# EAGLE design w20-cloudV1-(3_3)OHW (EAGLE 6.6.0)
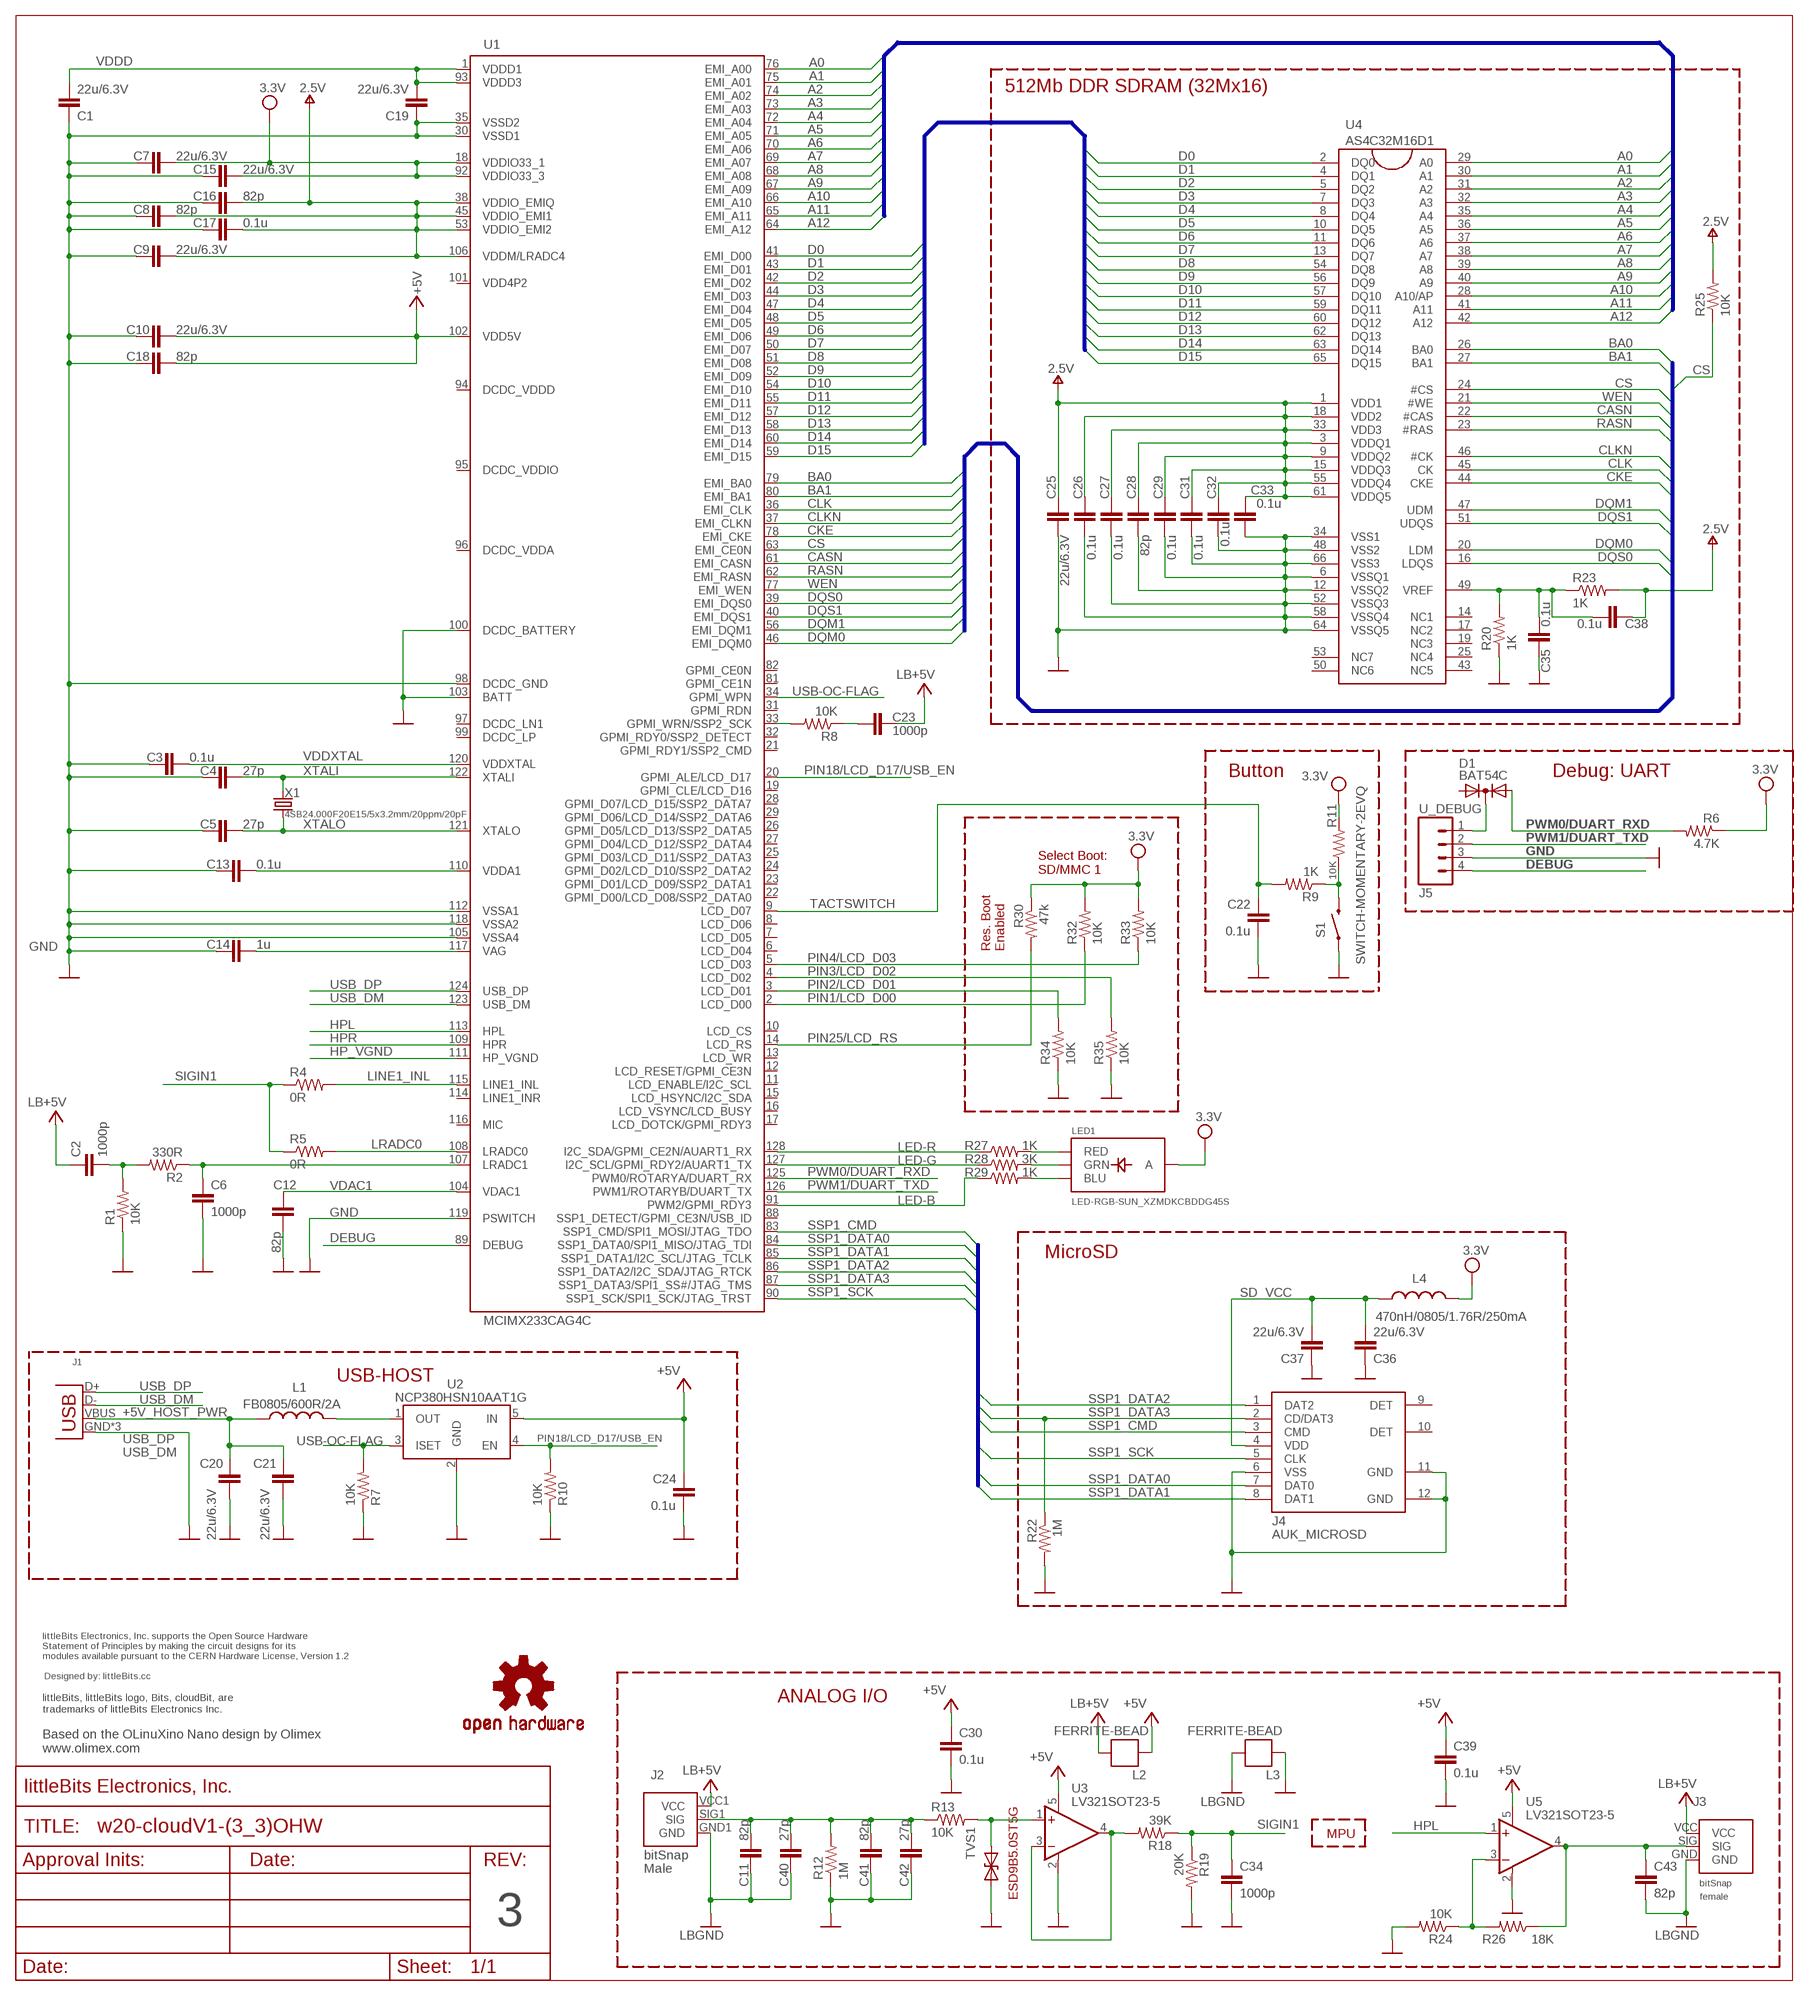
[diagram p0: schematic, sheet 1]

## Parts
C1  22u/6.3V  CAPCAP-0603  [CAP-0603]
C2  1000p  CAPCAP-0603  [CAP-0603]
C3  0.1u  CAPCAP-0402  [CAP-0402]
C4  27p  CAPCAP-0402  [CAP-0402]
C5  27p  CAPCAP-0402  [CAP-0402]
C6  1000p  CAPCAP-0402  [CAP-0402]
C7  22u/6.3V  CAPCAP-0603  [CAP-0603]
C8  82p  CAPCAP-0402  [CAP-0402]
C9  22u/6.3V  CAPCAP-0603  [CAP-0603]
C10  22u/6.3V  CAPCAP-0603  [CAP-0603]
C11  82p  CAPCAP-0402  [CAP-0402]
C12  82p  CAPCAP-0402  [CAP-0402]
C13  0.1u  CAPCAP-0402  [CAP-0402]
C14  1u  CAPCAP-0402  [CAP-0402]
C15  22u/6.3V  CAPCAP-0603  [CAP-0603]
C16  82p  CAPCAP-0402  [CAP-0402]
C17  0.1u  CAPCAP-0402  [CAP-0402]
C18  82p  CAPCAP-0402  [CAP-0402]
C19  22u/6.3V  CAPCAP-0603  [CAP-0603]
C20  22u/6.3V  CAPCAP-0603  [CAP-0603]
C21  22u/6.3V  CAPCAP-0603  [CAP-0603]
C22  0.1u  CAPCAP-0402  [CAP-0402]
C23  1000p  CAPCAP-0603  [CAP-0603]
C24  0.1u  CAPCAP-0402  [CAP-0402]
C25  22u/6.3V  CAPCAP-0603  [CAP-0603]
C26  0.1u  CAPCAP-0402  [CAP-0402]
C27  0.1u  CAPCAP-0402  [CAP-0402]
C28  82p  CAPCAP-0402  [CAP-0402]
C29  0.1u  CAPCAP-0402  [CAP-0402]
C30  0.1u  CAPCAP-0402  [CAP-0402]
C31  0.1u  CAPCAP-0402  [CAP-0402]
C32  0.1u  CAPCAP-0402  [CAP-0402]
C33  0.1u  CAPCAP-0402  [CAP-0402]
C34  1000p  CAPCAP-0402  [CAP-0402]
C35  0.1u  CAPCAP-0402  [CAP-0402]
C36  22u/6.3V  CAPCAP-0603  [CAP-0603]
C37  22u/6.3V  CAPCAP-0603  [CAP-0603]
C38  0.1u  CAPCAP-0402  [CAP-0402]
C39  0.1u  CAPCAP-0402  [CAP-0402]
C40  27p  CAPCAP-0402  [CAP-0402]
C41  82p  CAPCAP-0402  [CAP-0402]
C42  27p  CAPCAP-0402  [CAP-0402]
C43  82p  CAPCAP-0402  [CAP-0402]
D1  BAT54C  DIODE_AC-CA_  [SOT23C]
J1  USBFEMALE  [USB-A-H-FEMALE]
J2  BITSNAP_V03_MALE  [BITSNAP_V03_MALE]
J3  BITSNAP_V03_FEMALE  [BITSNAP_V03_FEMALE]
J4  AUK_MICROSD  [AUK_TFC08WP01-R1K-H]
J5  U_DEBUG  HDR-4SM_SML  [SIP4-SM-0.1IN-NOS.S.]
L1  FB0805/600R/2A  L-USL0805_5MIL_DWS  [L0805_5MIL_DWS]
L2  FERRITE-BEAD  [R0603]
L3  FERRITE-BEAD  [R0603]
L4  470nH/0805/1.76R/250mA  L-USL0805_5MIL_DWS  [L0805_5MIL_DWS]
LED1  LED-RGB-SUN_XZMDKCBDDG45S  [LED-RGB-SUN_XZMDKCBDDG45S]
R1  10K  RESISTOR0603  [RES-0603]
R2  330R  RESISTOR0603  [RES-0603]
R4  0R  RESISTOR0603  [RES-0603]
R5  0R  RESISTOR0603  [RES-0603]
R6  4.7K  RESISTOR0603  [RES-0603]
R7  10K  RESISTOR0603  [RES-0603]
R8  10K  RESISTOR0603  [RES-0603]
R9  1K  RESISTOR0603  [RES-0603]
R10  10K  RESISTOR0603  [RES-0603]
R11  10K  RESISTOR0603  [RES-0603]
R12  1M  RESISTOR0603  [RES-0603]
R13  10K  RESISTOR0603  [RES-0603]
R18  39K  RESISTOR0603  [RES-0603]
R19  20K  RESISTOR0603  [RES-0603]
R20  1K  RESISTOR0603  [RES-0603]
R22  1M  RESISTOR0603  [RES-0603]
R23  1K  RESISTOR0603  [RES-0603]
R24  10K  RESISTOR0603  [RES-0603]
R25  10K  RESISTOR0603  [RES-0603]
R26  18K  RESISTOR0603  [RES-0603]
R27  1K  RESISTOR0603  [RES-0603]
R28  3K  RESISTOR0603  [RES-0603]
R29  1K  RESISTOR0603  [RES-0603]
R30  47k  RESISTOR0603  [RES-0603]
R32  10K  RESISTOR0603  [RES-0603]
R33  10K  RESISTOR0603  [RES-0603]
R34  10K  RESISTOR0603  [RES-0603]
R35  10K  RESISTOR0603  [RES-0603]
S1  SWITCH-MOMENTARY-2EVQ  [TACTILE-SWITCH-EVQ-PE104K]
TVS1  DIODE-TVSSOD-923  [SOD-923]
U1  MCIMX233CAG4C  MCIMX233DAG4B_LD  [TQFP128LD]
U2  NCP380HSN10AAT1G  SY6280  [SOT23-5]
U3  LV321SOT23-5  [SOT23-5]
U4  AS4C32M16D1  HY5DU121622D(L)T(P)-J  [66TSOP-II]
U5  LV321SOT23-5  [SOT23-5]
U$2  OSHWCREDIT  [OSHWCREDIT]
U$4  OSHW-LOGOL  [OSHW-LOGO-L]
U$5  FRAME-LETTER-OHWOHW  [FABDWG01-OHW]
X1  4SB24.000F20E15/5x3.2mm/20ppm/20pF  HC49/S_E4SB25.000F20E15  [HCX-4S]

## Nets
+5V: C10.2 C18.2 C24.1 C30.1 C39.1 L2.2 U1.102(VDD5V) U2.5(IN) U3.5(V+) U5.5(V+)
+5V_HOST_PWR: C20.1 C21.1 J1.VBUS L1.1
A0: U1.76(EMI_A00) U4.29(A0)
A1: U1.75(EMI_A01) U4.30(A1)
A2: U1.74(EMI_A02) U4.31(A2)
A3: U1.73(EMI_A03) U4.32(A3)
A4: U1.72(EMI_A04) U4.35(A4)
A5: U1.71(EMI_A05) U4.36(A5)
A6: U1.70(EMI_A06) U4.37(A6)
A7: U1.69(EMI_A07) U4.38(A7)
A8: U1.68(EMI_A08) U4.39(A8)
A9: U1.67(EMI_A09) U4.40(A9)
A10: U1.66(EMI_A10) U4.28(A10/AP)
A11: U1.65(EMI_A11) U4.41(A11)
A12: U1.64(EMI_A12) U4.42(A12)
BA0: U1.79(EMI_BA0) U4.26(BA0)
BA1: U1.80(EMI_BA1) U4.27(BA1)
CASN: U1.61(EMI_CASN) U4.22(#CAS)
CKE: U1.78(EMI_CKE) U4.44(CKE)
CLK: U1.36(EMI_CLK) U4.45(CK)
CLKN: U1.37(EMI_CLKN) U4.46(#CK)
CS: R25.1 U1.63(EMI_CE0N) U4.24(#CS)
D0: U1.41(EMI_D00) U4.2(DQ0)
D1: U1.43(EMI_D01) U4.4(DQ1)
D2: U1.42(EMI_D02) U4.5(DQ2)
D3: U1.44(EMI_D03) U4.7(DQ3)
D4: U1.47(EMI_D04) U4.8(DQ4)
D5: U1.48(EMI_D05) U4.10(DQ5)
D6: U1.49(EMI_D06) U4.11(DQ6)
D7: U1.50(EMI_D07) U4.13(DQ7)
D8: U1.51(EMI_D08) U4.54(DQ8)
D9: U1.52(EMI_D09) U4.56(DQ9)
D10: U1.54(EMI_D10) U4.57(DQ10)
D11: U1.55(EMI_D11) U4.59(DQ11)
D12: U1.57(EMI_D12) U4.60(DQ12)
D13: U1.58(EMI_D13) U4.62(DQ13)
D14: U1.60(EMI_D14) U4.63(DQ14)
D15: U1.59(EMI_D15) U4.65(DQ15)
DEBUG: J5.4 U1.89(DEBUG)
DQM0: U1.46(EMI_DQM0) U4.20(LDM)
DQM1: U1.56(EMI_DQM1) U4.47(UDM)
DQS0: U1.39(EMI_DQS0) U4.16(LDQS)
DQS1: U1.40(EMI_DQS1) U4.51(UDQS)
GND [pwr-II]: C1.1 C3.1 C4.1 C5.1 C6.2 C7.1 C8.1 C9.1 C10.1 C12.2 C13.1 C14.1 C15.1 C16.1 C17.1 C18.1 C19.1 C20.2 C21.2 C22.2 C24.2 C25.1 C26.1 C27.1 C28.1 C29.1 C30.2 C31.1 C32.1 C33.1 C34.2 C35.1 C36.1 C37.1 C39.2 C41.2 C42.2 J1.GND J1.GND@1(GND) J1.GND@2(GND) J4.6(VSS) J4.11(GND) J4.12(GND) J5.3 L3.2 R1.1 R7.1 R10.1 R12.1 R19.2 R20.1 R22.2 R24.2 R34.1 R35.1 S1.P$1 TVS1.1(A) U1.30(VSSD1) U1.35(VSSD2) U1.98(DCDC_GND) U1.100(DCDC_BATTERY) U1.103(BATT) U1.105(VSSA4) U1.112(VSSA1) U1.118(VSSA2) U1.119(PSWITCH) U2.2(GND) U3.2(V-) U4.6(VSSQ1) U4.12(VSSQ2) U4.34(VSS1) U4.48(VSS2) U4.52(VSSQ3) U4.58(VSSQ4) U4.64(VSSQ5) U4.66(VSS3) U5.2(V-)
HP_VGND: U1.111(HP_VGND)
HPL: U1.113(HPL) U5.1(+IN)
HPR: U1.109(HPR)
LB+5V: C2.1 C23.2 J2.VCC1(VCC) J3.VCC L2.1
LBGND [pwr-II]: C11.2 C40.2 C43.2 J2.GND1(GND) J3.GND L3.1
LED-B: R29.1 U1.91(PWM2/GPMI_RDY3)
LED-G: R28.1 U1.127(I2C_SCL/GPMI_RDY2/AUART1_TX)
LED-R: R27.1 U1.128(I2C_SDA/GPMI_CE2N/AUART1_RX)
LINE1_INL: R4.2 U1.115(LINE1_INL)
LRADC0: R5.2 U1.108(LRADC0)
N$1: R9.1 R11.1 S1.P$2
N$2: LED1.1(RED) R27.2
N$3: L1.2 U2.1(OUT)
N$4: LED1.4(GRN) R28.2
N$5: LED1.3(BLU) R29.2
N$7: C35.2 C38.2 R20.2 R23.1 U4.49(VREF)
N$8: R18.2 U3.3(-IN) U3.4(OUT)
N$10: R13.2 TVS1.2(C) U3.1(+IN)
N$11: D1.3(K) J5.1
N$12: R24.1 R26.2 U5.3(-IN)
N$13: C11.1 C40.1 C41.1 C42.1 J2.SIG1(SIG) R12.2 R13.1
N$14: C43.1 J3.SIG R26.1 U5.4(OUT)
N$15: C13.2 U1.110(VDDA1)
N$17: R8.2 U1.33(GPMI_WRN/SSP2_SCK)
N$18: C23.1 R8.1
N$19: C6.1 R2.1 U1.107(LRADC1)
N$20: C2.2 R1.2 R2.2
N$25: C14.2 U1.117(VAG)
PIN1/LCD_D00: R32.1 U1.2(LCD_D00)
PIN2/LCD_D01: R34.2 U1.3(LCD_D01)
PIN3/LCD_D02: R35.2 U1.4(LCD_D02)
PIN4/LCD_D03: R33.1 U1.5(LCD_D03)
PIN18/LCD_D17/USB_EN: R10.2 U1.20(GPMI_ALE/LCD_D17) U2.4(EN)
PIN25/LCD_RS: R30.2 U1.14(LCD_RS)
PWM0/DUART_RXD: D1.2(A2) R6.2 U1.125(PWM0/ROTARYA/DUART_RX)
PWM1/DUART_TXD: J5.2 U1.126(PWM1/ROTARYB/DUART_TX)
RASN: U1.62(EMI_RASN) U4.23(#RAS)
SD_VCC: C36.2 C37.2 J4.4(VDD) L4.2
SIGIN1: C34.1 R4.1 R5.1 R18.1 R19.1
SSP1_CMD: J4.3(CMD) U1.83(SSP1_CMD/SPI1_MOSI/JTAG_TDO)
SSP1_DATA0: J4.7(DAT0) U1.84(SSP1_DATA0/SPI1_MISO/JTAG_TDI)
SSP1_DATA1: J4.8(DAT1) U1.85(SSP1_DATA1/I2C_SCL/JTAG_TCLK)
SSP1_DATA2: J4.1(DAT2) U1.86(SSP1_DATA2/I2C_SDA/JTAG_RTCK)
SSP1_DATA3: J4.2(CD/DAT3) R22.1 U1.87(SSP1_DATA3/SPI1_SS#/JTAG_TMS)
SSP1_SCK: J4.5(CLK) U1.90(SSP1_SCK/SPI1_SCK/JTAG_TRST)
TACTSWITCH: C22.1 R9.2 U1.9(LCD_D07)
USB-OC-FLAG: R7.2 U1.34(GPMI_WPN) U2.3(ISET)
USB_DM: J1.D- U1.123(USB_DM)
USB_DP: J1.D+ U1.124(USB_DP)
V+: C8.2 C9.2 C16.2 C17.2 C25.2 C26.2 C27.2 C28.2 C29.2 C31.2 C32.2 C33.2 C38.1 R23.2 R25.2 U1.38(VDDIO_EMIQ) U1.45(VDDIO_EMI1) U1.53(VDDIO_EMI2) U1.106(VDDM/LRADC4) U4.1(VDD1) U4.3(VDDQ1) U4.9(VDDQ2) U4.15(VDDQ3) U4.18(VDD2) U4.33(VDD3) U4.55(VDDQ4) U4.61(VDDQ5) ; supply symbol labelled 2.5V
VCC [pwr-II]: C7.2 C15.2 L4.1 LED1.2(A) R6.1 R11.2 R30.1 R32.2 R33.2 U1.18(VDDIO33_1) U1.92(VDDIO33_3) ; supply symbol labelled 3.3V
VDAC1: C12.1 U1.104(VDAC1)
VDDD: C1.2 C19.2 U1.1(VDDD1) U1.93(VDDD3)
VDDXTAL: C3.2 U1.120(VDDXTAL)
WEN: U1.77(EMI_WEN) U4.21(#WE)
XTALI: C4.2 U1.122(XTALI) X1.2
XTALO: C5.2 U1.121(XTALO) X1.1
Unconnected: D1.1(A1) J4.9(DET) J4.10(DET) U1.6(LCD_D04) U1.7(LCD_D05) U1.8(LCD_D06) U1.10(LCD_CS) U1.11(LCD_ENABLE/I2C_SCL) U1.12(LCD_RESET/GPMI_CE3N) U1.13(LCD_WR) U1.15(LCD_HSYNC/I2C_SDA) U1.16(LCD_VSYNC/LCD_BUSY) U1.17(LCD_DOTCK/GPMI_RDY3) U1.19(GPMI_CLE/LCD_D16) U1.21(GPMI_RDY1/SSP2_CMD) U1.22(GPMI_D00/LCD_D08/SSP2_DATA0) U1.23(GPMI_D01/LCD_D09/SSP2_DATA1) U1.24(GPMI_D02/LCD_D10/SSP2_DATA2) U1.25(GPMI_D03/LCD_D11/SSP2_DATA3) U1.26(GPMI_D05/LCD_D13/SSP2_DATA5) U1.27(GPMI_D04/LCD_D12/SSP2_DATA4) U1.28(GPMI_D07/LCD_D15/SSP2_DATA7) U1.29(GPMI_D06/LCD_D14/SSP2_DATA6) U1.31(GPMI_RDN) U1.32(GPMI_RDY0/SSP2_DETECT) U1.81(GPMI_CE1N) U1.82(GPMI_CE0N) U1.88(SSP1_DETECT/GPMI_CE3N/USB_ID) U1.94(DCDC_VDDD) U1.95(DCDC_VDDIO) U1.96(DCDC_VDDA) U1.97(DCDC_LN1) U1.99(DCDC_LP) U1.101(VDD4P2) U1.114(LINE1_INR) U1.116(MIC) U4.14(NC1) U4.17(NC2) U4.19(NC3) U4.25(NC4) U4.43(NC5) U4.50(NC6) U4.53(NC7)

## Buses
A[0..12]
D[0..15]
SSP1_CMD,SSP1_DATA0,SSP1_SCK,SSP1_DATA3,SSP1_DATA1,SSP1_DATA2
BA[0..1],CLK,CLKN,CKE,CS,CASN,RASN,WEN,DQM[0..1],DQS[0..1]

## Notes on the sheet
- 512Mb DDR SDRAM (32Mx16)
- Button | Debug: UART
- Select Boot:
  SD/MMC 1
- Res. Boot 
  Enabled
- MicroSD
- USB-HOST
- ANALOG I/O
- Based on the OLinuXino Nano design by Olimex
  www.olimex.com
- MPU
- 3

## Library data of the parts
C1-C43 = LITTLEBITS:CAP
D1 = semicon-smd-ipc:DIODE_AC-CA_: DUAL DIODE
J1 = LITTLEBITS:USB: USB Connectors USB-B-PTH is fully proven SKU : PRT-00139 USB-miniB is fully proven SKU : PRT-00587 USB-A-PCB is untested. USB-A-H is throughly reviewed, but untested. Spark Fun Electronics SKU : PRT-00437 USB-B-SMT is throughly reviewed, but untested. Needs silkscreen touching up. USB-A-S has not been used/tested USB-MB-H has not been used/tested
J2 = bitSnap:BITSNAP_V03_MALE
J3 = bitSnap:BITSNAP_V03_FEMALE
J4 = LITTLEBITS:AUK_MICROSD: AUK TFC08WP01-R1K-H Micro SD Card Slot.
J5 = LITTLEBITS:HDR-4: Header 4 Standard 4-pin 0.1" header. Use with straight break away headers (SKU : PRT-00116), right angle break away headers (PRT-00553), swiss pins (PRT-00743), machine pins (PRT-00117), and female headers (PRT-00115). Molex polarized connector foot print use with SKU : PRT-08231 with associated crimp pins and housings.
L1 L4 = rcl:L-US: INDUCTOR, American symbol
L2 L3 = LITTLEBITS:FERRITE-BEAD
LED1 = LITTLEBITS:LED-RGB-SUN_XZMDKCBDDG45S
R1 R2 R4-R13 R18-R20 R22-R30 R32-R35 = LITTLEBITS:RESISTOR
S1 = LITTLEBITS:SWITCH-MOMENTARY-2
TVS1 = LITTLEBITS:DIODE-TVS: Bidirectional Transient Voltage Suppression Diode: Device conducts in avalanche mode after reaching a part dependent voltage threshold. Used for limiting voltage spikes on ESD sensitive inputs and outputs.; IEC_ESD_PROT0: +/-18kV; LB_PN: ?; MPN: ESD9B5.0ST5G; V_CLAMP: ?; V_OPERATION: 5V
U1 = LITTLEBITS:MCIMX233DAG4B: i.MX23
U2 = OLIMEX_IC:SY6280
U3 U5 = LITTLEBITS:LV321
U4 = OLIMEX_IC:HY5DU121622D(L)T(P)
U$2 = LITTLEBITS:OSHWCREDIT
U$4 = SparkFun_NEW:OSHW-LOGO: Open Source Hardware Logo This logo indicates the piece of hardware it is found on incorporates a OSHW license and/or adheres to the definition of open source hardware found here: http://freedomdefined.org/OSHW
U$5 = LITTLEBITS:FRAME-LETTER-OHW
X1 = crystal:HC49/S: CRYSTAL

## Board
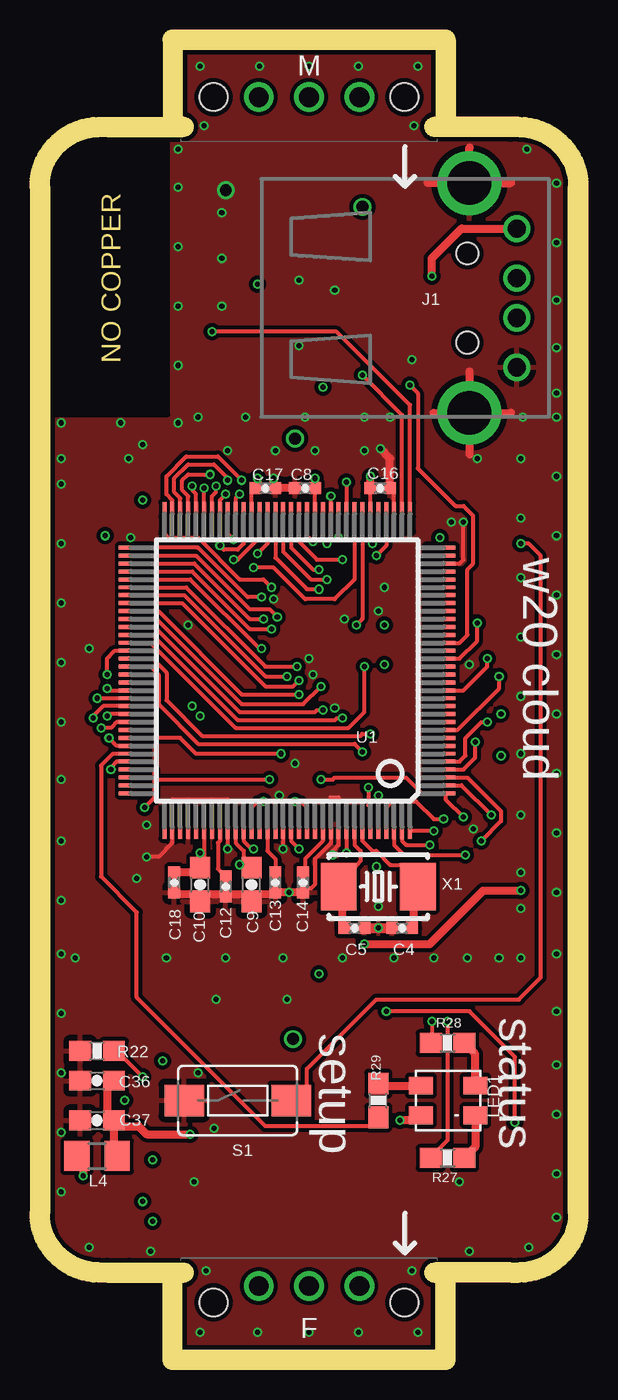
[diagram p1: board, top side]
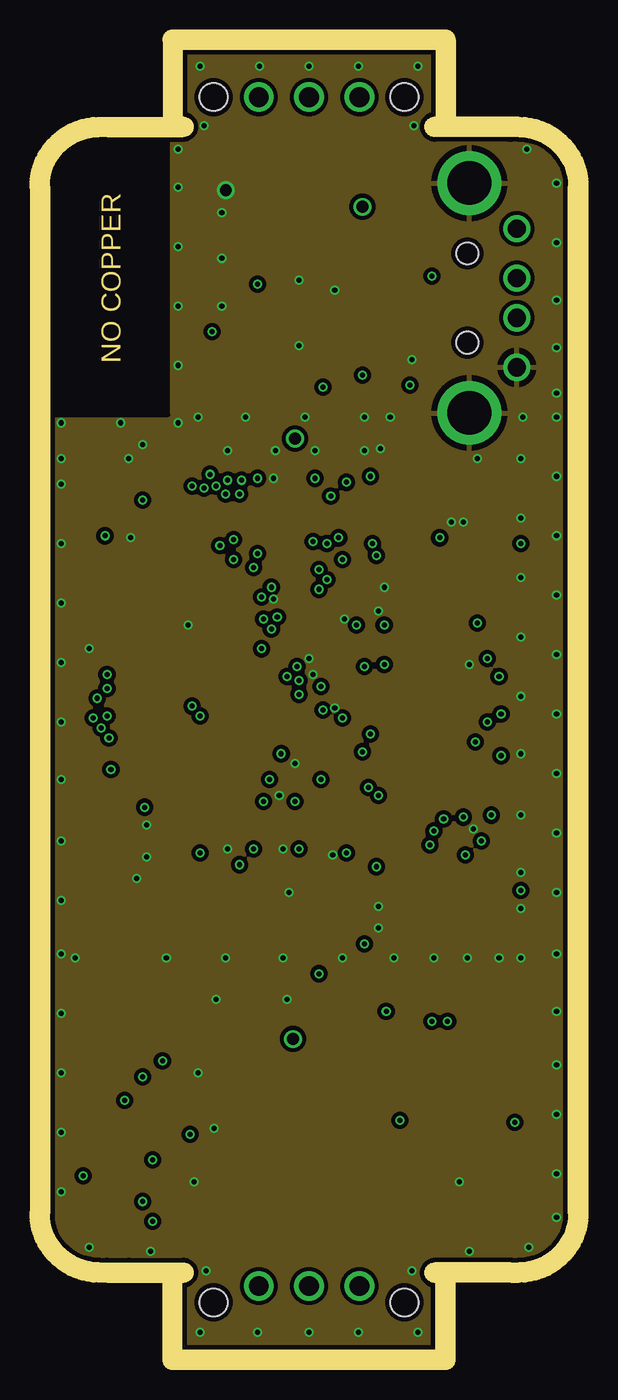
[diagram p2: board, inner layer Route2]
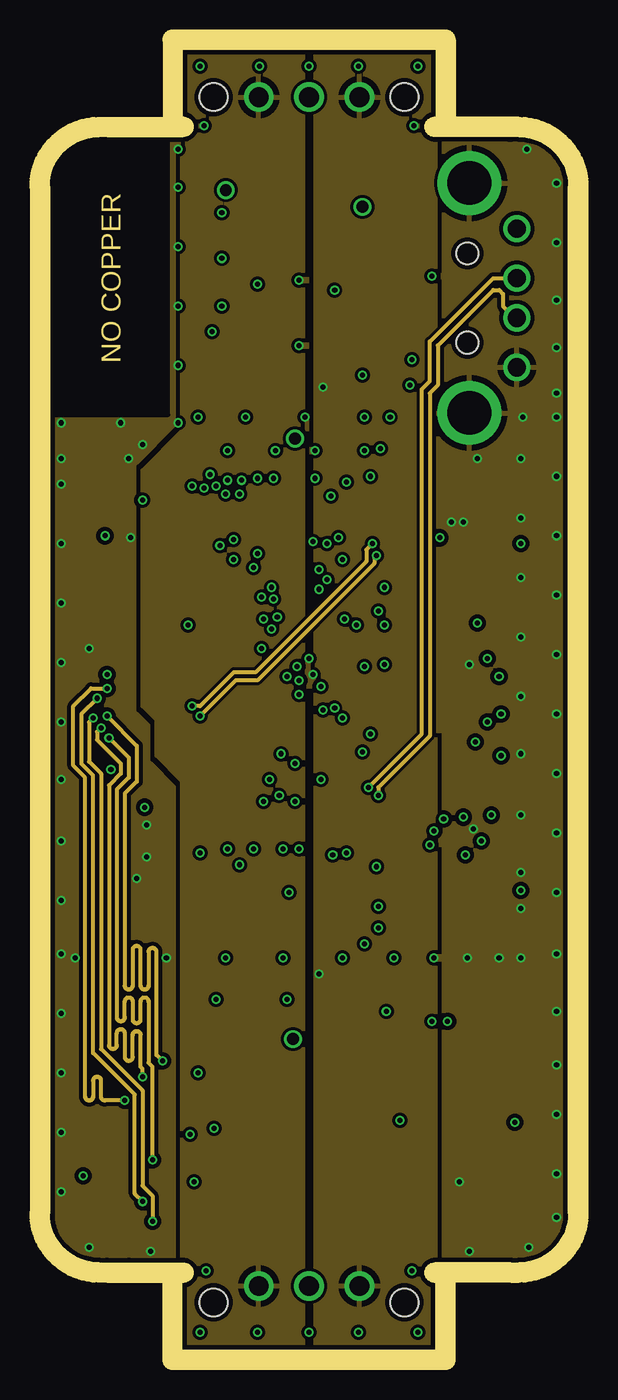
[diagram p3: board, inner layer Route3]
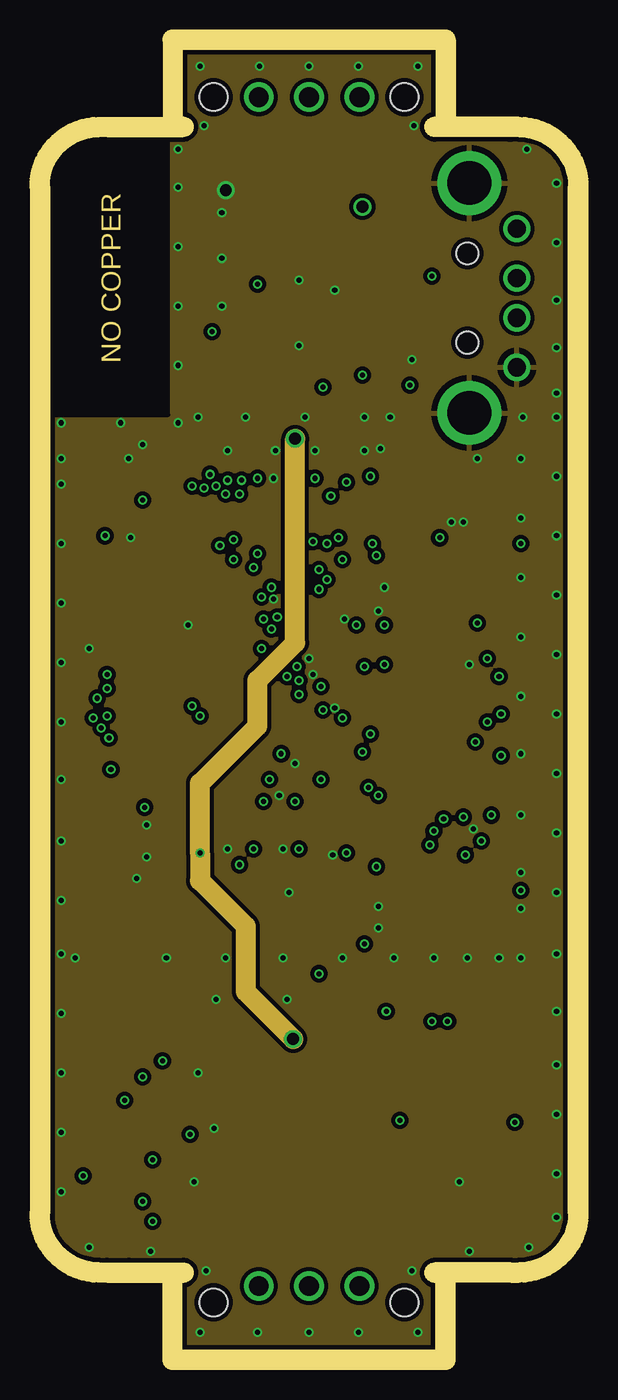
[diagram p4: board, inner layer Route14]
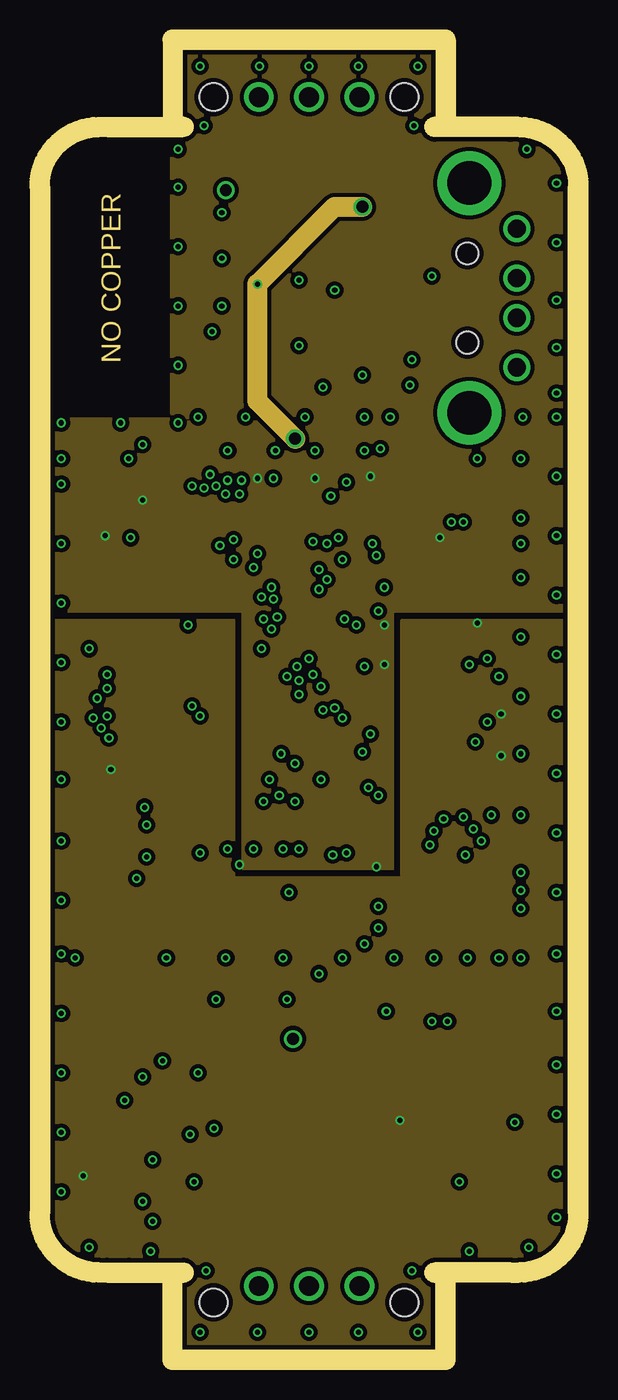
[diagram p5: board, inner layer Route15]
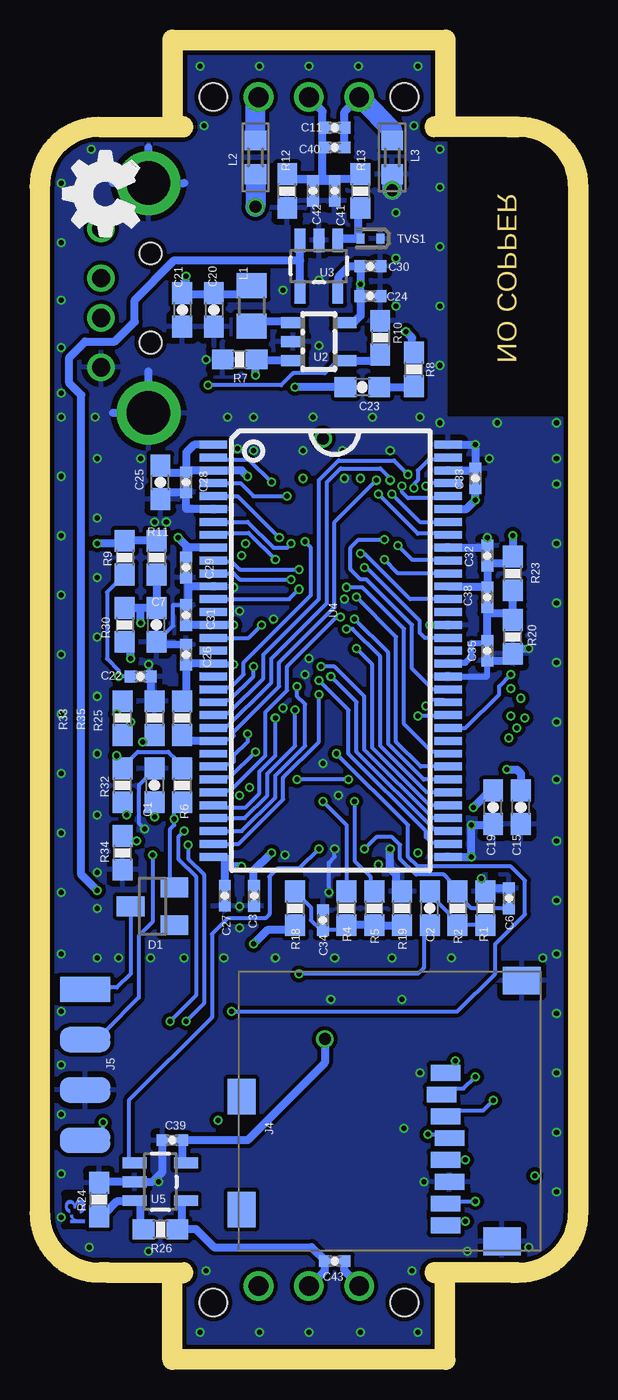
[diagram p6: board, bottom side, seen from below]

Size 26.2 x 65.63 mm. Coordinates in mm from the lower left corner, seen from the top.
Outline: 23.2,61.23 23.7,61.23 arc-90 26.2,58.73 26.2,6.9 arc-90 23.7,4.4 23.2,4.4
Outline: 3.1,61.23 2.5,61.23 arc90 0,58.73 0,6.9 arc90 2.5,4.4 4,4.4
Copper layers (1*2+3*14+15*16): Top 0.035mm / dielectric 0.13mm / Route2 0.035mm / dielectric 0.6mm / Route3 0.035mm / dielectric 0.13mm / Route14 0.035mm / dielectric 0.6mm / Route15 0.035mm / dielectric 0.13mm / Bottom 0.035mm
Design rules "littleBits6-LAYERDRC": minimum track width 5mil, minimum drill 10mil, track to track 0.15mm, track to pad 0.15mm, pad to pad 0.15mm, via to via 0.15mm, smd to smd 1mil, copper to edge 10mil, drill to drill 8mil, minimum pad ring 5mil, minimum via ring 4mil, stop-mask expansion 4mil, vias tented up to drill 25mil, thermal gap 12mil
Milling: 10 lines

### Footprints (pad centres in the part's own frame; a part is rotated, then mirrored left to right if it is on the bottom)
CAP-0603 = smd 1.1 x 1: 1 -0.85,0; 2 0.85,0
CAP-0402 = smd 0.6 x 0.6: 1 -0.5,0; 2 0.5,0
SOT23C = smd 1 x 1.4: 1 -0.95,-1.1; 2 0.95,-1.1; 3 0,1.1
USB-A-H-FEMALE = drill 0.914: D+ 2.4,-1; D- 2.4,1; GND 2.4,-3.5; VBUS 2.4,3.5 | drill 2.2: GND@1 0,5.8; GND@2 0,-5.8 | hole 1.1: -0.1,2.25; -0.1,-2.25
BITSNAP_V03_MALE = drill 1: GND1 9.145,2.61; SIG1 6.605,2.61; VCC1 4.065,2.61 | hole 1.4: 1.785,2.61; 11.425,2.61
BITSNAP_V03_FEMALE = drill 1: GND 4.065,3.44; SIG 6.605,3.44; VCC 9.145,3.44 | hole 1.4: 1.785,2.61; 11.425,2.61
AUK_TFC08WP01-R1K-H = smd 0.8 x 1.5: 1 -1.2,10.3; 2 -0.1,10.1; 3 1,10.3; 4 2.1,10.5; 5 3.2,10.3; 6 4.3,10.5; 7 5.4,10.3; 8 6.5,10.3 | smd 1.8 x 1.4: 9 0,0; 10 5.7,0 | smd 1.4 x 1.9: 11 -5.85,14.15; 12 7.3,13.15
SIP4-SM-0.1IN-NOS.S. = smd 1.27 x 2.54: 1 -3.81,0; 2 -1.27,0; 3 1.27,0; 4 3.81,0
L0805_5MIL_DWS = smd 1.27 x 1.524: 1 -1.016,0; 2 1.016,0
R0603 = smd 1 x 1.1: 1 -0.85,0; 2 0.85,0
LED-RGB-SUN_XZMDKCBDDG45S = smd 0.9 x 1.2: 1 0,0; 2 0,2.75; 3 1.5,2.75; 4 1.5,0; 5 1.5,2.75
RES-0603 = smd 1.1 x 1: 1 -0.85,0; 2 0.85,0
TACTILE-SWITCH-EVQ-PE104K = smd 2 x 1.6: P$1 -2.7,0; P$2 2.7,0
SOD-923 = smd 0.4 x 0.5: 1 -0.5,0; 2 0.5,0
TQFP128LD = smd 0.2 x 1.5: 1 -6.2,-7.75; 2 -5.8,-7.75; 3 -5.4,-7.75; 4 -5,-7.75; 5 -4.6,-7.75; 6 -4.2,-7.75; 7 -3.8,-7.75; 8 -3.4,-7.75; 9 -3,-7.75; 10 -2.6,-7.75; 11 -2.2,-7.75; 12 -1.8,-7.75; 13 -1.4,-7.75; 14 -1,-7.75; 15 -0.6,-7.75; 16 -0.2,-7.75; 17 0.2,-7.75; 18 0.6,-7.75; 19 1,-7.75; 20 1.4,-7.75; 21 1.8,-7.75; 22 2.2,-7.75; 23 2.6,-7.75; 24 3,-7.75; 25 3.4,-7.75; 26 3.8,-7.75; 27 4.2,-7.75; 28 4.6,-7.75; 29 5,-7.75; 30 5.4,-7.75; 31 5.8,-7.75; 32 6.2,-7.75; 65 6.2,7.75; 66 5.8,7.75; 67 5.4,7.75; 68 5,7.75; 69 4.6,7.75; 70 4.2,7.75; 71 3.8,7.75; 72 3.4,7.75; 73 3,7.75; 74 2.6,7.75; 75 2.2,7.75; 76 1.8,7.75; 77 1.4,7.75; 78 1,7.75; 79 0.6,7.75; 80 0.2,7.75; 81 -0.2,7.75; 82 -0.6,7.75; 83 -1,7.75; 84 -1.4,7.75; 85 -1.8,7.75; 86 -2.2,7.75; 87 -2.6,7.75; 88 -3,7.75; 89 -3.4,7.75; 90 -3.8,7.75; 91 -4.2,7.75; 92 -4.6,7.75; 93 -5,7.75; 94 -5.4,7.75; 95 -5.8,7.75; 96 -6.2,7.75 | smd 1.5 x 0.2: 33 7.75,-6.2; 34 7.75,-5.8; 35 7.75,-5.4; 36 7.75,-5; 37 7.75,-4.6; 38 7.75,-4.2; 39 7.75,-3.8; 40 7.75,-3.4; 41 7.75,-3; 42 7.75,-2.6; 43 7.75,-2.2; 44 7.75,-1.8; 45 7.75,-1.4; 46 7.75,-1; 47 7.75,-0.6; 48 7.75,-0.2; 49 7.75,0.2; 50 7.75,0.6; 51 7.75,1; 52 7.75,1.4; 53 7.75,1.8; 54 7.75,2.2; 55 7.75,2.6; 56 7.75,3; 57 7.75,3.4; 58 7.75,3.8; 59 7.75,4.2; 60 7.75,4.6; 61 7.75,5; 62 7.75,5.4; 63 7.75,5.8; 64 7.75,6.2; 97 -7.75,6.2; 98 -7.75,5.8; 99 -7.75,5.4; 100 -7.75,5; 101 -7.75,4.6; 102 -7.75,4.2; 103 -7.75,3.8; 104 -7.75,3.4; 105 -7.75,3; 106 -7.75,2.6; 107 -7.75,2.2; 108 -7.75,1.8; 109 -7.75,1.4; 110 -7.75,1; 111 -7.75,0.6; 112 -7.75,0.2; 113 -7.75,-0.2; 114 -7.75,-0.6; 115 -7.75,-1; 116 -7.75,-1.4; 117 -7.75,-1.8; 118 -7.75,-2.2; 119 -7.75,-2.6; 120 -7.75,-3; 121 -7.75,-3.4; 122 -7.75,-3.8; 123 -7.75,-4.2; 124 -7.75,-4.6; 125 -7.75,-5; 126 -7.75,-5.4; 127 -7.75,-5.8; 128 -7.75,-6.2
SOT23-5 = smd 0.55 x 1.2: 1 -0.95,-1.3; 2 0,-1.3; 3 0.95,-1.3; 4 0.95,1.3; 5 -0.95,1.3
66TSOP-II = smd 0.4 x 1.4: 1 -10.4,-5.925; 2 -9.75,-5.925; 3 -9.1,-5.925; 4 -8.45,-5.925; 5 -7.8,-5.925; 6 -7.15,-5.925; 7 -6.5,-5.925; 8 -5.85,-5.925; 9 -5.2,-5.925; 10 -4.55,-5.925; 11 -3.9,-5.925; 12 -3.25,-5.925; 13 -2.6,-5.925; 14 -1.95,-5.925; 15 -1.3,-5.925; 16 -0.65,-5.925; 17 0,-5.925; 18 0.65,-5.925; 19 1.3,-5.925; 20 1.95,-5.925; 21 2.6,-5.925; 22 3.25,-5.925; 23 3.9,-5.925; 24 4.55,-5.925; 25 5.2,-5.925; 26 5.85,-5.925; 27 6.5,-5.925; 28 7.15,-5.925; 29 7.8,-5.925; 30 8.45,-5.925; 31 9.1,-5.925; 32 9.75,-5.925; 33 10.4,-5.925; 34 10.4,5.925; 35 9.75,5.925; 36 9.1,5.925; 37 8.45,5.925; 38 7.8,5.925; 39 7.15,5.925; 40 6.5,5.925; 41 5.85,5.925; 42 5.2,5.925; 43 4.55,5.925; 44 3.9,5.925; 45 3.25,5.925; 46 2.6,5.925; 47 1.95,5.925; 48 1.3,5.925; 49 0.65,5.925; 50 0,5.925; 51 -0.65,5.925; 52 -1.3,5.925; 53 -1.95,5.925; 54 -2.6,5.925; 55 -3.25,5.925; 56 -3.9,5.925; 57 -4.55,5.925; 58 -5.2,5.925; 59 -5.85,5.925; 60 -6.5,5.925; 61 -7.15,5.925; 62 -7.8,5.925; 63 -8.45,5.925; 64 -9.1,5.925; 65 -9.75,5.925; 66 -10.4,5.925
HCX-4S = smd 1.8 x 2.4: 1 -2,0; 2 2,0

### Placement (x,y rotation side)
C1  20.9,28.49 270 bottom
C2  7,22.29 90 bottom
C3  15.87,22.92 90 bottom
C4  17.8,21.29 0 top
C5  15.4,21.29 180 top
C6  3,22.79 90 bottom
C7  20.8,36.59 90 bottom
C8  12.9,43.49 0 top
C9  10.2,23.49 90 top
C10  7.6,23.49 90 top
C11  11.8,61.69 0 bottom
C12  8.9,23.39 270 top
C13  11.4,23.59 90 top
C14  12.8,23.59 90 top
C15  2.4,27.39 90 bottom
C16  16.7,43.49 180 top
C17  10.9,43.49 180 top
C18  6.3,23.59 90 top
C19  3.8,27.39 90 bottom
C20  17.9,52.49 270 bottom
C21  19.5,52.49 270 bottom
C22  21.6,33.99 0 bottom
C23  10.4,48.59 180 bottom
C24  10,53.19 0 bottom
C25  20.6,43.79 90 bottom
C26  19.3,35.09 270 bottom
C27  17.35,22.92 90 bottom
C28  19.3,43.79 90 bottom
C29  19.3,39.49 90 bottom
C30  10,54.69 0 bottom
C31  19.3,37.09 270 bottom
C32  4.1,40.09 270 bottom
C33  4.7,43.99 270 bottom
C34  12.4,21.69 90 bottom
C35  4.1,35.29 90 bottom
C36  2.4,13.59 0 top
C37  2.4,11.59 0 top
C38  4.1,37.99 270 bottom
C39  20,10.59 180 bottom
C40  11.8,60.69 0 bottom
C41  11.8,58.49 270 bottom
C42  12.9,58.49 270 bottom
C43  11.8,4.49 0 bottom
D1  21,22.39 90 bottom
DRILEGEND  [DRILEGEND]  -59.42,-26.48 0 top  (outside the outline)
J1  21.2,53.09 0 top
J2  19.71,65.84 180 top
J3  6.5,-0.21 0 top
J4  16.5,12.79 270 bottom
J5  24.4,14.39 270 bottom
L1  16,52.69 270 bottom
L2  15.8,60.19 270 bottom
L3  8.9,60.19 270 bottom
L4  2.4,9.79 0 top
LED1  21.5,11.84 90 top
R1  4.2,22.29 270 bottom
R2  5.6,22.29 270 bottom
R4  11.2,22.29 90 bottom
R5  9.8,22.29 90 bottom
R6  19.5,28.49 270 bottom
R7  16.6,49.99 0 bottom
R8  7.8,49.49 90 bottom
R9  22.4,39.99 270 bottom
R10  9.5,51.09 270 bottom
R11  20.8,39.99 270 bottom
R12  14.2,58.49 90 bottom
R13  10.5,58.49 270 bottom
R18  13.8,22.29 270 bottom
R19  8.4,22.29 90 bottom
R20  2.8,35.99 90 bottom
R22  2.4,15.09 180 top
R23  2.8,39.19 90 bottom
R24  23.7,7.59 90 bottom
R25  19.5,31.89 90 bottom
R26  20.6,6.09 180 bottom
R27  20.1,9.69 0 top
R28  20.1,15.49 0 top
R29  16.6,12.59 90 top
R30  22.4,36.59 270 bottom
R32  22.5,28.49 90 bottom
R33  22.5,31.89 90 bottom
R34  22.5,25.09 90 bottom
R35  20.9,31.89 270 bottom
S1  9.5,12.59 0 top
TVS1  10,56.09 180 bottom
U1  12,34.29 90 top
U2  12.6,50.89 270 bottom
U3  12.6,54.7 180 bottom
U4  12,35.29 270 bottom
U5  20.6,8.49 270 bottom
U$1  [OSHW_FILLX150_NOTEXT]  21.7,55.39 0 top
U$2  -139.8,-9.21 0 top  (outside the outline)
U$4  -72,-12.21 0 top  (outside the outline)
U$5  6.5,19.79 0 top
X1  16.6,23.39 0 top

### Tracks (layer width: path | path; a pad name or v marks a point on that pad's centre or on a via)
+5V  (via drill 0.25, 0.6)
  Top 0.2: U1.102 7.8,24.38 C10.2
  Top 0.203: C10.2 7.55,24.51 7.62,24.61 7.83,24.6
  Top 0.4: C18.2 7.3,24.09 7.6,24.39 v7.6,25.09 C10.2
  Route14 1: v12.4,45.99 12.4,35.69 10.5,33.79 10.5,31.49 7.6,28.59 v7.6,25.09 7.6,23.69 9.9,21.39 9.9,18.09 v12.3,15.69
  Route15 1: v12.4,45.99 10.5,47.89 v10.5,53.79 14.4,57.69 v15.8,57.69
  Bottom 0.2: 19.5,9.49 U5.5 | U3.5 11.6,53.4
  Bottom 0.4: 19.5,10.69 C39.1 | C39.1 19.5,9.49 | v12.3,15.69 12.3,14.49 16.2,10.59 C39.1 | U2.5 11.25,51.89 10.8,51.89 10.5,52.19 C24.1 v10.5,53.79 C30.1 11.08,54.69 11.6,54.17 11.6,53.4
  Bottom 1: L2.2 v15.8,57.69
+5V_HOST_PWR  (via drill 0.25)
  Top 0.4: v19.3,54.19 19.3,55.09 20.8,56.59 J1.VBUS
  Bottom 0.4: L1.1 16.2,53.49 16.2,53.29 18,53.29 C20.1 17.95,53.29 19.3,53.29 C21.1 19.3,53.39 v19.3,54.19
A0  (via drill 0.25 pad 0.46)
  Top 0.2: U1.76 5.2,36.09 9.5,31.79 14.41,31.79 14.51,31.89 v14.8,31.89
  Bottom 0.2: U4.29 17.7,27.39 16.3,27.39 15.6,28.09 15.6,29.19 14.8,29.99 v14.8,31.89
A1  (via drill 0.25 pad 0.46)
  Top 0.2: U1.75 5.3,36.49 9.6,32.19 13.4,32.19 13.5,32.29 v13.8,32.29
  Bottom 0.2: U4.30 16.35,26.84 15.2,27.99 15.2,29.09 13.8,30.49 v13.8,32.29
A2  (via drill 0.25 pad 0.46)
  Top 0.2: U1.74 5.4,36.89 9.7,32.59 12.8,32.59 v13.7,33.49
  Bottom 0.2: U4.31 16.5,26.19 14.8,27.89 14.8,28.99 13.3,30.49 13.3,32.59 13.7,32.99 v13.7,33.49
A3  (via drill 0.25 pad 0.46)
  Top 0.2: U1.73 5.5,37.29 9.7,33.09 v12.6,33.09
  Bottom 0.2: U4.32 16.65,25.54 14.4,27.79 14.4,28.89 12.6,30.69 v12.6,33.09
A4  (via drill 0.25 pad 0.46)
  Top 0.2: U1.72 6.7,37.69 10.9,33.49 12.3,33.49 v12.6,33.79
  Bottom 0.2: U4.35 6.3,25.59 6.9,25.59 7.2,25.89 7.2,26.19 11.1,30.09 11.1,32.29 v12.6,33.79
A5  (via drill 0.25 pad 0.46)
  Top 0.2: U1.71 6.8,38.09 10.9,33.99 v12,33.99
  Bottom 0.2: U4.36 6.7,26.19 10.7,30.19 10.7,32.69 v12,33.99
A6  (via drill 0.25 pad 0.46)
  Top 0.2: U1.70 6.9,38.49 10.9,34.49 v12.5,34.49
  Bottom 0.2: U4.37 6.85,26.84 10.3,30.29 10.3,32.99 11.8,34.49 v12.5,34.49
A7  (via drill 0.25 pad 0.46)
  Top 0.2: U1.69 7.1,38.89 10.6,35.39 v10.7,35.39
  Bottom 0.2: U4.38 7,27.49 9.9,30.39 9.9,34.59 v10.7,35.39
A8  (via drill 0.25 pad 0.46)
  Top 0.2: U1.68 7.2,39.29 10.1,36.39 v11.2,36.39
  Bottom 0.2: U4.39 7.15,28.14 9.5,30.49 9.5,34.99 10.9,36.39 v11.2,36.39
A9  (via drill 0.25 pad 0.46)
  Top 0.2: U1.67 7.3,39.69 10.1,36.89 v10.8,36.89
  Bottom 0.2: U4.40 7.3,28.79 9.1,30.59 9.1,35.19 v10.8,36.89
A10  (via drill 0.25 pad 0.46)
  Top 0.2: U1.66 7.4,40.09 10.1,37.39 11.1,37.39 v11.5,36.99
  Bottom 0.2: U4.28 17.9,28.09 arc-90 17.95,28.24 17.05,28.24 15.3,29.99 15.3,32.19 14.2,33.29 14.2,34.49 11.7,36.99 v11.5,36.99
A11  (via drill 0.25)
  Top 0.2: v10.7,37.99 10,37.99 7.5,40.49 U1.65
  Bottom 0.2: U4.41 7.45,29.44 8.7,30.69 8.7,35.99 v10.7,37.99
A12  (via drill 0.25 pad 0.46)
  Top 0.2: U1.64 5.8,41.19 6,40.99 7.5,40.99 9.6,38.89 10.8,38.89 v11.2,38.49
  Bottom 0.2: U4.42 6.1,30.19 6.9,30.19 8.3,31.59 8.3,36.39 10.4,38.49 v11.2,38.49
BA0  (via drill 0.25 pad 0.46)
  Top 0.2: U1.79 5.2,34.89 5.9,34.19 5.9,32.79 7.7,30.99 15.7,30.99 15.8,31.09 v16.2,31.09
  Bottom 0.2: v16.2,31.09 16.2,30.69 16.9,29.99 16.9,29.69 17.05,29.54 17.8,29.54 17.8,29.49 U4.26
BA1  (via drill 0.25 pad 0.46)
  Top 0.2: U1.80 5.1,34.49 5.5,34.09 5.5,32.59 7.5,30.59 15.4,30.59 v15.8,30.19
  Bottom 0.2: v15.8,30.19 17.1,28.89 17.7,28.89 U4.27
CASN  (via drill 0.25 pad 0.46)
  Top 0.2: U1.61 7,43.09 6.7,43.39 6.7,43.89 7,44.19 v8.1,44.19
  Bottom 0.2: U4.22 17.88,32.09 17.75,32.14 17.15,32.14 15.4,33.89 15.4,35.09 12.6,37.89 12.6,43.89 11.6,44.89 8.8,44.89 v8.1,44.19
CKE  (via drill 0.25)
  Top 0.2: v2.9,34.09 2.9,34.89 3.3,35.29 U1.78
  Bottom 0.2: U4.44 5.2,31.39 3.5,33.09 3.5,33.49 v2.9,34.09
CLK  (via drill 0.25, 0.25 pad 0.46)
  Top 0.2: U1.36 17,40.59 v16.5,40.09
  Route3 0.2: v16.5,40.09 16.4,39.99 16.4,39.69 10.5,33.79 9.4,33.79 v7.6,31.99
  Bottom 0.2: U4.45 6.55,32.04 6.6,31.99 v7.6,31.99
CLKN  (via drill 0.25, 0.25 pad 0.46)
  Top 0.2: U1.37 16.6,40.99 v16.3,40.69
  Route3 0.2: v16.3,40.69 16,40.39 16,39.79 10.4,34.19 9.3,34.19 7.6,32.49 v7.2,32.49
  Bottom 0.2: U4.46 6.2,32.69 6.3,32.79 6.9,32.79 v7.2,32.49
CS  (via drill 0.25 pad 0.46)
  Top 0.2: U1.63 6.2,42.89 5.9,43.19 5.9,44.09 6.9,45.09 8.5,45.09 v9.7,43.89
  Bottom 0.2: U4.24 17.35,30.84 17.05,30.84 16.9,30.99 16.9,31.19 14.6,33.49 14.6,34.69 11.8,37.49 11.8,41.79 v9.7,43.89
  Bottom 0.406: U4.24 19.46,30.74 arc-90 R25.1
D0  (via drill 0.25)
  Top 0.2: v15,43.79 U1.41
  Bottom 0.2: U4.2 17.6,44.94 16.15,44.94 v15,43.79
D1  (via drill 0.25 pad 0.46)
  Top 0.2: U1.43 v14.2,43.09
  Bottom 0.2: U4.4 16.55,43.74 15.9,43.09 v14.2,43.09
D2  (via drill 0.25 pad 0.46)
  Top 0.2: U1.42 v14.6,40.99
  Bottom 0.2: U4.5 16.7,43.09 v14.6,40.99
D3  (via drill 0.25 pad 0.46)
  Top 0.2: v14,40.69 13.8,40.89 U1.44
  Bottom 0.2: U4.7 16.2,41.79 14.9,40.49 14.2,40.49 v14,40.69
D4  (via drill 0.25 pad 0.46)
  Top 0.2: U1.47 12.6,40.79 13.5,39.89 v14.8,39.89
  Bottom 0.2: U4.8 17.7,41.09 17.55,41.24 16.15,41.24 v14.8,39.89
D5  (via drill 0.25 pad 0.46)
  Top 0.2: U1.48 12.2,40.49 13.3,39.39 v13.6,39.39
  Bottom 0.2: U4.10 17.88,39.79 17,39.79 16.6,39.39 v13.6,39.39
D6  (via drill 0.25 pad 0.46)
  Top 0.2: U1.49 11.8,40.29 13.2,38.89 v14,38.89
  Bottom 0.2: U4.11 16.9,39.19 16.6,38.89 v14,38.89
D7  (via drill 0.25 pad 0.46)
  Top 0.2: U1.50 11.4,39.99 13,38.39 v13.6,38.39
  Bottom 0.2: U4.13 14.1,37.89 v13.6,38.39
D8  (via drill 0.25 pad 0.46)
  Top 0.2: U1.51 11,40.69 v10.5,40.19
  Bottom 0.2: U4.54 8,37.89 10.3,40.19 v10.5,40.19
D9  (via drill 0.25 pad 0.46)
  Top 0.2: U1.52 10.6,40.99 9.5,39.89 v9.3,39.89
  Bottom 0.2: U4.56 8.6,39.19 v9.3,39.89
D10  (via drill 0.25 pad 0.46)
  Top 0.2: U1.54 9.8,40.69 9.5,40.39 8.8,40.39 v8.6,40.59
  Bottom 0.2: v8.6,40.59 7.9,39.89 6.1,39.89 U4.57
D11  (via drill 0.25)
  Top 0.2: v9.6,43.19 9.4,42.99 U1.55
  Bottom 0.2: U4.59 6.4,41.19 7.6,41.19 v9.6,43.19
D12  (via drill 0.25)
  Top 0.2: U1.57 8.6,42.89 v8.9,43.19
  Bottom 0.2: v8.9,43.19 7.5,41.79 U4.60
D13  (via drill 0.25 pad 0.46)
  Top 0.2: U1.58 8.2,43.09 8.4,43.29 v8.4,43.59
  Bottom 0.2: U4.62 6.3,42.99 8.1,42.99 8.4,43.29 v8.4,43.59
D14  (via drill 0.25 pad 0.46)
  Top 0.2: U1.60 7.4,43.19 7.2,43.39 v7.2,43.59
  Bottom 0.2: U4.63 7.05,43.74 v7.2,43.59
D15  (via drill 0.25 pad 0.46)
  Top 0.2: U1.59 v7.8,43.49
  Bottom 0.2: U4.65 6.1,44.99 6.15,44.94 7.05,44.94 7.6,44.39 7.6,43.89 7.8,43.69 v7.8,43.49
DEBUG  (via drill 0.25)
  Top 0.2: v23.5,11.49 23.5,14.79 21.2,17.09 v17,17.09 | v11.7,30.09 7.4,30.09 6.6,30.89 U1.89
  Bottom 0.2: J5.4 23.5,10.89 v23.5,11.49 | v17,17.09 5.6,17.09 3.7,18.99 3.7,20.49 2.2,21.99 2.2,23.69 2.9,24.39 7.6,24.39 8.1,24.89 8.1,26.49 v11.7,30.09
DQM0  (via drill 0.25 pad 0.46)
  Top 0.2: U1.46 13,41.09 v13.3,40.79
  Bottom 0.2: U4.20 17.8,33.39 17.75,33.44 17.05,33.44 16.4,34.09 16.4,34.69 13,38.09 13,40.49 v13.3,40.79
DQM1  (via drill 0.25 pad 0.46)
  Top 0.2: U1.56 9,41.19 v9.3,40.89
  Bottom 0.2: U4.47 6.85,33.34 7.9,34.39 7.9,36.59 10.2,38.89 10.5,38.89 11,39.39 11,40.49 10.6,40.89 v9.3,40.89
DQS0  (via drill 0.25 pad 0.46)
  Top 0.2: U1.39 15.8,36.89 v15.5,36.59
  Bottom 0.2: U4.16 16.15,35.94 v15.5,36.59
DQS1  (via drill 0.25 pad 0.46)
  Top 0.2: U1.40 15.4,38.89 14.4,37.89 12.9,37.89 11.3,39.49 v10.3,39.49
  Bottom 0.2: U4.51 7.25,35.94 7.5,36.19 7.5,36.79 10.2,39.49 v10.3,39.49
GND  (via drill 0.25, 0.25 pad 0.46, 0.6)
  Top 0.2: U1.35 17.4,43.49 17.2,43.69 17.2,44.99 | U1.30 20.7,39.69 20.9,39.89 v20.9,41.79 | U1.118 14.2,25.59 13.4,24.79 13.4,23.49 13.2,23.29 12.9,23.29 12.7,23.09 v12.1,23.09 | v9,25.29 U1.105 9,27.79 8.2,27.79 | U1.112 v11.8,25.29 | 7,27.79 6.2,27.79 U1.98 6.2,25.59 5.5,24.89 v4.9,24.89 | 7,27.79 8.2,27.79 | U1.100 7,27.79 | U1.103 8.2,27.79 | C5.1 v16.6,21.3 | U1.119 14.6,25.49 14.3,25.19 v14.3,24.99 | 14.2,27.09 14.2,27.89 14.6,27.89 14.6,26.69
  Top 0.4: C10.1 7.85,22.34 7.3,22.99 6.3,22.99 C18.1 | 10.1,22.79 9.9,22.99 9.1,22.99 9,22.89 C12.2 8.9,22.99 8,22.99 7.8,22.79 7.5,22.79 | 10.38,22.52 C9.1 10.1,22.79 | v16.6,21.3 v16.6,21.29 | 10.1,22.79 10.4,22.79 10.6,22.99 11.4,22.99 C13.1 v12.1,23.09 C14.1 | 10.1,22.79 10.08,22.6 | v11.3,43.99 11.3,43.59 C17.1 C8.1 | 21.2,49.39 J1.GND@2 | J1.GND@2 21.2,45.19 | J1.GND@2 23.3,47.29 | J1.GND@1 21.2,57.59 | J1.GND@1 23.3,58.89 | J1.GND@1 21.2,60.69 | J1.GND@1 19.1,58.89 | C16.1 17.2,44.99 v16.7,45.49 | 19.4,47.29 J1.GND@2
  Top 0.508: C5.1 C4.1 | C9.1 10.2,22.79 10.1,22.79 | 7.5,22.79 C10.1
  Bottom 0.2: v12.1,23.09 12.1,24.59 11.8,24.89 v11.8,25.29 | v7,36.59 U4.52 | 4.91,44.39 C33.1 | C7.1 19.95,36.55 19.95,37.59 19.94,37.6 C31.1 | C1.1 21.1,29.09 21.7,28.49 21.7,26.59 v21.4,26.29 | v21.2,34.59 21.2,33.99 C22.2 | 4.2,23.29 R1.1
  Bottom 0.3: U4.48 4.1,33.99 C35.1
  Bottom 0.4: 2.7,35.19 2.7,35.39 | C19.1 3.89,26.5 4,26.49 v4.9,26.49 v4.9,24.89 U4.34 | R24.2 23.55,8.49 U5.2 21,8.49 20.5,8.99 C39.2 | C26.1 20.6,35.58 | 19.2,38.89 19.2,38.49 | 19.2,38.49 19.2,37.79 | U4.12 19.15,38.54 arc-90 19.2,38.49 | U4.6 19.3,42.44 C28.1 20.3,43.29 C25.1 | C35.1 2.8,34.79 | 2.8,34.79 2.7,34.79 | U4.58 4.1,40.49 C32.1 v4.1,40.99 | U4.66 v4.7,45.69 C33.1 4.81,44.39 U4.64 | J1.GND@1 21.2,60.69 | J1.GND@1 19.4,58.89 | J1.GND@1 23,58.89 | 21.2,49.39 J1.GND@2 23,47.29 | R19.2 8.7,23.49 8.7,23.99 9,24.29 v9,25.29 | R20.1 2.8,34.79 | C6.2 4.2,23.29 | C22.2 21.1,32.94 R35.1
  Bottom 0.406: 20.6,35.58 C7.1 | C29.1 19.2,38.89 | 19.2,37.79 19.3,37.69 C31.1 | 2.7,35.39 v2,35.39
  Bottom 0.508: R20.1 2.7,35.19
  Bottom 1: L3.2 v8.9,58.54
  other vias: 12,17.69 20.7,8.49 20.3,41.79 8.4,17.69 8.7,52.69 12.6,50.69 12.6,53.99 8.7,57.39 14.4,53.49 18.3,49.99 18.6,0.89 7.6,0.89 18.6,64.79 7.6,64.79 6.5,60.59 6.5,46.79 6.5,52.69 25.6,55.89 0.6,46.79 0.6,40.69 25.6,48.29 23.9,47.09 23.8,35.99 24.2,5.19 25.6,11.89 18.3,3.99 7.9,3.99 5.1,4.99 16.6,22.39 13.3,34.09 14.9,36.89 25.6,58.89 23.8,44.99 23.8,38.99 23.8,32.99 23.8,22.29 23.8,24.09 25.6,23.09 25.6,19.99 25.6,8.89 10.5,0.89 10.6,64.79 6.5,49.69 6.5,55.69 0.6,43.69 3.6,46.79 18.4,61.79 7.8,61.79 0.6,37.69 0.6,34.69 0.6,31.69 0.6,28.79 0.6,25.69 0.6,22.69 0.6,19.99 0.6,16.99 0.6,10.99 2,5.19 0.6,13.99 24.1,60.59 25.6,50.59 25.6,52.99 25.6,44.09 25.6,41.09 25.6,38.09 25.6,35.09 25.6,32.09 25.6,29.09 25.6,26.09 23.8,26.99 23.8,30.09 15.6,0.89 15.6,64.79 25.6,17.09 25.6,14.39 21.2,4.99 7.3,8.49 8.3,11.19 7.5,13.99 0.6,7.99 16.6,37.29 14.4,32.39 12.4,29.59 11.3,37.89 13.1,34.89 8.7,55.09 11.6,27.99 4.4,23.79 5.9,19.79 1.3,19.79 8.9,19.79 11.8,19.79 14.8,19.79 17.4,19.79 21.1,19.79 23.8,19.79 6.5,58.69 25.6,47.09 25.6,6.69 13.1,0.89 13.1,64.79 9.9,47.09 4,44.99 0.6,44.99 23.8,41.99 21.6,44.99 9,45.39 11.4,45.39 15.9,45.39 13.4,45.39 16.9,38.49 19.4,19.79 7.5,47.09 12.9,47.09 15.9,47.09 17.2,47.09 22.7,19.79
  pour Top (isolate 0.2, rank 3): -0.67,-1.05 26.73,-1.05 26.73,66.02 -0.67,66.02
  pour Bottom (isolate 0.2, rank 3): 39.44,-13.75 39.44,78.72 -13.36,78.72 -13.36,-13.75
  pour Route2 (isolate 0.203, rank 3): 29.27,-3.59 29.27,68.56 -3.21,68.56 -3.21,-3.59
  pour Route3 (isolate 0.203, rank 3): 31.82,-6.13 -5.74,-6.13 -5.74,71.1 31.82,71.1
  pour Route14 (isolate 0.203, rank 3): 34.36,-8.67 -8.29,-8.67 -8.29,73.64 34.36,73.64
HPL  (via drill 0.25)
  Top 0.2: U1.113 12.2,25.69 v12.6,25.29
  Bottom 0.2: v12.6,25.29 13.6,24.29 14.7,24.29 15.1,23.89 15.1,21.99 15.3,21.79 17.2,21.79 18,20.99 18,16.79 22.2,12.59 22.2,9.49 U5.1
LB+5V  (via drill 0.25)
  Bottom 0.2: 15.8,63.07 J2.VCC1 | C23.2 11.3,48.59 | C2.1 7.3,21.19 7.3,19.29 7.6,18.99 v13.6,18.99
  Bottom 0.4: 11.3,48.59 v13.8,48.59
  Bottom 1: L2.1 15.8,63.07
  pour Route3: 19.5,65.59 13.4,65.59 13.4,-0.01 19.5,-0.01
LBGND
  Bottom 0.2: 10.4,63.06 J2.GND1
  Bottom 0.4: C40.2 C11.2 11.3,62.49 10.9,62.89 J2.GND1 | J3.GND 10.6,3.27 10.6,3.29 11.3,3.99 C43.2
  Bottom 1: L3.1 8.9,61.56 10.4,63.06
  pour Route3: 6.7,65.59 12.8,65.59 12.8,-0.01 6.7,-0.01 6.7,28.69 5.4,29.99 5.4,31.79 4.7,32.49 4.7,44.39 6.7,46.39
LED-B
  Top 0.2: U1.91 3.2,30.09 2.6,29.49 2.6,23.89 4.4,22.09 4.4,17.79 10.9,11.29 16.2,11.29 16.2,11.34 R29.1
LED-G  (via drill 0.25)
  Top 0.2: v19.2,25.49 18,25.49 17.8,25.69 U1.127 | v19.3,16.59 19.3,15.59 R28.1
  Bottom 0.2: v19.2,25.49 19.2,24.79 18.4,23.99 18.4,17.49 v19.3,16.59
LED-R  (via drill 0.25)
  Top 0.2: v19.4,26.19 18.2,26.19 U1.128 | v20.1,16.59 20.1,10.59 19.25,9.74 R27.1
  Bottom 0.2: v19.4,26.19 19.7,25.89 19.7,24.79 18.8,23.89 18.8,17.89 v20.1,16.59
LINE1_INL  (via drill 0.25)
  Top 0.2: U1.115 13,27.39 12.7,27.69 v12.4,27.69
  Bottom 0.2: v12.4,27.69 11.2,26.49 11.2,23.19
  Bottom 0.4: 11.2,22.79 R4.2 11.2,23.19
LRADC0  (via drill 0.25)
  Top 0.2: U1.108 10.2,27.39 10.5,27.69 v10.8,27.69
  Bottom 0.2: v10.8,27.69 10.8,24.69 10,23.89 10,23.09
  Bottom 0.4: 10,23.09 R5.2
N$1  (via drill 0.25)
  Top 0.2: S1.P$2 13,13.19 13,14.19 16.5,17.69 23.7,17.69 24.8,18.79 24.8,40.09 24.2,40.69 v23.8,40.69
  Bottom 0.2: R9.1 22.55,40.69
  Bottom 0.4: R11.1 R9.1 | 22.55,40.69 v23.8,40.69
N$2
  Top 0.4: LED1.1 21.5,10.24 R27.2
N$3
  Bottom 0.2: U2.1 14.2,51.89
  Bottom 0.4: 14.2,51.89 15.68,51.89 L1.2
N$4
  Top 0.2: 21.5,13.29 LED1.4
  Top 0.4: LED1.4 21.5,14.94 R28.2
N$5
  Top 0.2: R29.2 16.65,13.39 16.8,13.39 16.85,13.34
  Top 0.4: 16.85,13.34 LED1.3
N$7
  Bottom 0.3: U4.49 5.8,34.69 5.2,34.69 4.9,34.99 4.9,35.69 4,35.69 C35.2
  Bottom 0.4: C35.2 4.1,37.19 | R20.2 2.8,37.19 | 2.8,37.19 R23.1 | C38.2 4.1,37.19 | 4.1,37.19 2.8,37.19
N$8  (via drill 0.25)
  Top 0.4: v15.9,20.49 19.2,20.49 21.9,23.19 v23.8,23.19
  Bottom 0.2: U3.3
  Bottom 0.4: R18.2 14.05,21.19 15.2,21.19 v15.9,20.49 | v23.8,23.19 24.6,23.99 24.6,48.19 25.2,48.79 25.2,50.09 24.4,50.89 22.9,50.89 21.9,51.89 21.9,52.99 19.9,54.99 13.55,54.99 | U3.4 13.55,54.99 | 13.55,54.99 U3.3
N$10
  Bottom 0.4: R13.2 10.65,57.39 10.6,57.34 10.6,56.09 11.6,56.09 U3.1 11.64,56.09 TVS1.2
N$11
  Bottom 0.2: D1.3 22.1,18.99 22.8,18.29 23.9,18.29 J5.1
N$12
  Bottom 0.2: 22,7.49 U5.3 21.6,7.59
  Bottom 0.4: 22,7.49 22.8,7.49 23.45,6.84 R24.1 | R26.2 21.45,6.14 21.6,6.29 21.6,7.59
N$13
  Bottom 0.4: 13.8,59.09 12.41,59.09 | 12.41,59.09 12.41,60.69 | 12.41,60.69 12.41,61.69 | 12.41,61.69 12.41,62.51 12.59,62.69 13.1,63.19 J2.SIG1 | R13.1 10.65,59.09 13.8,59.09 | 13.8,59.09 R12.2 | C41.1 C42.1 12.5,58.99 12.41,59.09 | C11.1 12.41,61.69 | C40.1 12.41,60.69
N$14
  Bottom 0.2: 19.5,7.59 U5.4 19.05,7.54
  Bottom 0.4: 19.5,7.59 19.5,6.29 19.65,6.14 R26.1 18.8,6.09 17.9,5.19 12.96,5.19 12.27,4.49 C43.1 12.3,3.99 13.11,3.19 J3.SIG
N$15
  Top 0.2: U1.110 11,25.19 11.4,24.79 C13.2
N$16
  cutout Top: 0,61.19 0,47.19 6,47.19 6,61.19
  cutout Bottom: 0,61.19 0,47.19 6,47.19 6,61.19
  cutout Route15: 0,61.19 0,47.19 6,47.19 6,61.19
  cutout Route14: 0,61.19 0,47.19 6,47.19 6,61.19
  cutout Route3: 0,61.19 0,47.19 6,47.19 6,61.19
  cutout Route2: 0,61.19 0,47.19 6,47.19 6,61.19
N$17  (via drill 0.25)
  Top 0.2: U1.33 18.2,47.69 14.5,51.39 v8.2,51.39
  Bottom 0.2: R8.2 7.9,50.44
  Bottom 0.4: 7.9,50.44 7.9,51.09 v8.2,51.39
N$18
  Bottom 0.2: 8,48.59 7.95,48.64 R8.1
  Bottom 0.4: C23.1 8,48.59
N$19  (via drill 0.25)
  Top 0.2: U1.107 9.8,25.69 10.2,25.29 v10.3,25.29
  Bottom 0.2: C6.1 4.9,22.29 5.5,22.89 R2.1 5.9,23.59 6.3,23.99 7.7,23.99 8.5,24.79 8.5,25.49 8.9,25.89 9.7,25.89 v10.3,25.29
N$20
  Bottom 0.2: R1.2 R2.2 5.6,21.59 6.7,22.69 6.7,22.84 C2.2
N$25
  Top 0.2: U1.117 13.8,25.69 12.9,24.79 12.9,24.18 C14.2
  Top 0.203: C14.2 12.67,23.92
PIN1/LCD_D00  (via drill 0.25)
  Top 0.2: U1.2 20.8,28.49 v22.3,26.99
  Bottom 0.2: 22.55,27.59 arc90 R32.1
  Bottom 0.4: v22.3,26.99 22.3,27.39 22.55,27.59
PIN2/LCD_D01  (via drill 0.25)
  Top 0.2: U1.3 21.1,28.89 22.8,27.19 22.8,26.69 v21.8,25.69
  Bottom 0.2: R34.2 22.35,25.69 v21.8,25.69
PIN3/LCD_D02  (via drill 0.25)
  Top 0.2: U1.4 20.9,29.29 21.5,29.89 v21.5,30.69
  Bottom 0.2: v21.5,30.69 21.25,30.69 | 21.2,30.59 21.25,30.69 | 21.25,30.69 21.25,30.89 R35.2
PIN4/LCD_D03  (via drill 0.25)
  Top 0.2: U1.5 20.7,29.69 21,29.99 21,30.89 21.8,31.69 v22.1,31.69
  Bottom 0.2: v22.1,31.69 22.1,31.29 22.8,31.29 R33.1
PIN18/LCD_D17/USB_EN  (via drill 0.25)
  Top 0.2: U1.20 20.7,35.69 21.1,36.09 21.1,39.39 21.4,39.69 21.4,42.09 20.9,42.59 20.5,42.59 18.6,44.49 18.6,48.29 v18.2,48.69
  Bottom 0.2: 9.46,49.94 R10.2 | U2.4 11.65,49.94 12.3,49.29 13.9,49.29 14.5,48.69 v18.2,48.69
  Bottom 0.4: U2.4 9.46,49.94
PIN25/LCD_RS  (via drill 0.25)
  Top 0.2: U1.14 20.9,33.29 22.1,34.49 v22.1,34.89
  Bottom 0.2: 22.1,35.39 R30.2
  Bottom 0.4: v22.1,34.89 22.1,35.39
PWM0/DUART_RXD  (via drill 0.25)
  Top 0.2: U1.125 17,27.39 17.3,27.69 18.5,27.69 19.4,26.79 v19.9,26.79
  Bottom 0.2: R6.2 19.55,27.64 19.9,27.19 v19.9,26.79 19.9,26.49 20.1,26.29 20.1,23.79 19.7,23.39 D1.2
PWM1/DUART_TXD  (via drill 0.25)
  Top 0.2: v21,24.99 17.9,24.99 17.4,25.49 U1.126
  Bottom 0.2: v21,24.99 21,21.59 21.7,20.89 21.7,17.79 23.4,16.09 J5.2
RASN  (via drill 0.25 pad 0.46)
  Top 0.2: U1.62 6.6,42.99 6.3,43.29 6.3,43.99 7,44.69 8.3,44.69 9,43.99 v9,43.89
  Bottom 0.2: U4.23 17.9,31.39 17.8,31.49 17.4,31.29 15,33.69 15,34.89 12.2,37.69 12.2,43.79 11.5,44.49 9.5,44.49 9,43.99 v9,43.89
SD_VCC  (via drill 0.25)
  Top 0.2: 3.25,9.79 L4.2
  Top 0.4: C37.2 3.25,9.79 | C36.2 2.9,13.39 2.9,11.44 C37.2 | C37.2 3.45,11.29 4.5,11.29 4.9,10.89 v7.1,10.89
  Bottom 0.2: v7.1,10.89 5.7,10.89 5.6,10.69 J4.4
SIGIN1
  Bottom 0.2: 9.55,21.49 R5.1 9.7,21.39 | R19.1 8.5,21.44 8.5,21.39 | R4.1 11.2,21.19 C34.1 12.6,21.29 13,21.69 13,22.34 R18.1
  Bottom 0.4: R5.1 R4.1 | 8.5,21.39 9.7,21.39
SSP1_CMD  (via drill 0.25)
  Top 0.2: v2.9,33.39 3,33.29 U1.83
  Route3 0.2: v2.9,33.39 2.1,33.39 1.2,32.49 1.2,29.49 1.8,28.89 1.8,12.79 arc90 2,12.59 arc90 2.2,12.79 2.2,13.59 arc-90 2.4,13.79 arc-90 2.6,13.59 2.6,12.79 arc90 2.8,12.59 v3.8,12.59
  Bottom 0.2: J4.3 5.9,12.09 4.3,12.09 v3.8,12.59
SSP1_DATA0  (via drill 0.25)
  Top 0.2: U1.84 v2.4,32.89
  Route3 0.2: v2.4,32.89 1.6,32.09 1.6,29.59 2.2,28.99 2.2,14.99 4.3,12.89 4.3,7.89 v4.7,7.49
  Bottom 0.2: J4.7 5.9,7.49 v4.7,7.49
SSP1_DATA1  (via drill 0.25)
  Top 0.2: U1.85 2.7,32.49 2.2,31.99 v2.2,31.89
  Route3 0.2: v2.2,31.89 2,31.69 2,29.69 2.6,29.09 2.6,15.19 4.7,13.09 4.7,8.29 5.2,7.79 v5.2,6.49
  Bottom 0.2: J4.8 6,6.49 v5.2,6.49
SSP1_DATA2  (via drill 0.25)
  Top 0.2: U1.86 3,32.09 v2.9,31.99
  Route3 0.2: v2.9,31.99 4.4,30.49 4.4,28.69 3.8,28.09 3.8,18.39 arc90 4,18.19 arc90 4.2,18.39 4.2,20.19 arc-90 4.4,20.39 arc-90 4.6,20.19 4.6,18.39 arc90 4.8,18.19 arc90 5,18.39 5,20.09 arc-90 5.2,20.29 arc-90 5.4,20.09 5.4,14.89 v5.7,14.59
  Bottom 0.2: J4.1 5.7,14.19 v5.7,14.59
SSP1_DATA3  (via drill 0.25)
  Top 0.2: U1.87 3.4,31.69 3.1,31.39 v2.6,31.39 | R22.1 3.4,15.09 v4.7,13.79
  Route3 0.2: v2.6,31.39 2.4,31.19 2.4,30.79 3.6,29.59 3.6,29.09 3,28.49 3,15.39 arc90 3.2,15.19 arc90 3.4,15.39 3.4,15.99 arc-90 3.6,16.19 arc-90 3.8,15.99 3.8,14.79 arc90 4,14.59 arc90 4.2,14.79 4.2,15.89 arc-90 4.4,16.09 arc-90 4.6,15.89 4.6,14.29 4.7,14.19 v4.7,13.79
  Bottom 0.2: J4.2 6.2,13.19 5.3,13.19 v4.7,13.79
SSP1_SCK  (via drill 0.25)
  Top 0.2: U1.90 3.4,30.49 v3,30.89
  Route3 0.2: v3,30.89 4,29.89 4,28.89 3.4,28.29 3.4,16.79 arc90 3.6,16.59 arc90 3.8,16.79 3.8,17.59 arc-90 4,17.79 arc-90 4.2,17.59 4.2,16.69 arc90 4.4,16.49 arc90 4.6,16.69 4.6,17.59 arc-90 4.8,17.79 arc-90 5,17.59 5,14.49 5.2,14.29 v5.2,9.59
  Bottom 0.2: J4.5 v5.2,9.59
TACTSWITCH  (via drill 0.25)
  Top 0.2: U1.9 20.6,31.29 22.7,33.39 v22.7,33.99
  Bottom 0.2: C22.1 v22.7,33.99 22.7,34.29 23.3,34.89 23.3,38.24 R9.2
USB-OC-FLAG  (via drill 0.25)
  Top 0.2: U1.34 17.8,47.19 v15.8,49.19
  Bottom 0.2: 15.46,49.94 R7.2 15.8,49.94
  Bottom 0.4: U2.3 15.46,49.94 | v15.8,49.19 15.8,49.94
USB_DM  (via drill 0.25)
  Top 0.2: U1.123 16.2,27.39 16.1,27.49 v16.1,28.39
  Route3 0.2: v16.1,28.39 18.8,31.09 18.8,48.49 19.2,48.89 19.2,50.89 22.4,54.09 J1.D-
USB_DP  (via drill 0.25)
  Top 0.2: U1.124 v16.6,27.99
  Route3 0.2: v16.6,27.99 16.6,28.39 19.2,30.99 19.2,48.29 19.6,48.69 19.6,50.69 22.4,53.49 22.7,53.49 22.9,53.29 22.9,52.69 23.5,52.09 J1.D+
V+  (via drill 0.25, 0.25 pad 0.46)
  Top 0.2: 10.38,24.3 10.5,24.49 10.46,24.53 | U1.38 C16.2 | U1.53 10.2,43.58 C17.2 | U1.45 C8.2 13.4,43.59 | U1.106 9.4,25.59 9.8,25.19 9.8,24.78 C9.2 10.1,24.49
  Top 0.254: C9.2 10.38,24.3
  Top 0.305: C17.2 10.34,43.58
  Top 0.4: v9.6,24.49 10.1,24.49 | v10.5,43.99 10.5,43.49 C17.2 | v13.4,43.99 C8.2 | C16.2 v16.2,44.09
  Bottom 0.2: U4.33 17.35,24.89 17.3,24.39
  Bottom 0.3: U4.18 17.7,34.59 v16.9,34.59
  Bottom 0.305: 17.6,36.59 17.59,36.6 17.5,36.59
  Bottom 0.4: v16.9,36.59 17.5,36.59 17.6,36.59 U4.15 C31.2 arc-90 C31.2 19.12,36.63 | v19.7,40.99 19.2,40.49 U4.9 19.3,40.49 C29.2 | C27.2 17.35,24.89 | v16.5,24.39 17.3,24.39 | U4.18 19.35,34.64 | 19.35,34.64 19.4,34.69 | 19.35,34.64 C26.2 | 4.1,38.59 C32.2 4,39.69 2.8,39.69 R23.2 | 4.1,38.59 C38.1 | U4.55 4.15,38.54 arc-90 4.1,38.59 | 2.9,40.39 R23.2 | U4.61 5.15,42.44 v4.7,42.89 C33.2 | C28.2 19.01,44.39 U4.3 16.5,44.39 v16.2,44.09 | U4.1 18.9,45.69 19.3,45.29 C28.2 | C25.2 20.4,44.39 20.3,44.29 C28.2 | v2.8,41.09 R23.2
  Bottom 0.406: C26.2 19.3,32.89 19.39,32.48 R25.2
  pour Route15 (isolate 0.203, rank 3): 36.89,37.3 17.3,37.3 17.3,24.29 9.8,24.29 9.8,37.29 -10.82,37.27 -10.82,76.18 36.89,76.18
VCC  (via drill 0.25)
  Top 0.2: U1.92 3.4,29.69 3.1,29.39 v3.1,29.29 | U1.18 20.7,34.89 21.6,35.79 v21.6,36.69
  Top 0.4: L4.1 1.7,9.41 v1.7,8.79 | LED1.2 18.65,11.84 18.6,11.59 v17.7,11.59
  Bottom 0.2: R30.1 22.41,37.14 | v22.8,29.99 22.8,29.79 R32.2 | 22.8,29.29 R32.2 | 21.6,37.44 21.8,37.44 | R32.2 22.7,29.49 22.4,29.54 21.75,30.19 20.2,30.19 19.8,29.79 19.7,29.59 R6.1
  Bottom 0.4: v3.1,29.29 2.6,29.29 2.4,29.09 C15.2 | R30.1 21.8,37.44 C7.2 R11.2 | v21.6,36.69 21.6,37.44 | R33.2 22.8,32.44 v22.8,32.09
  pour Route15 (isolate 0.203, rank 3): 36.89,-11.21 36.89,36.8 17.8,36.8 17.8,23.79 9.3,23.79 9.3,36.79 -10.82,36.79 -10.82,-11.21
VDAC1
  Top 0.2: 8.94,24.04 C12.1 8.5,24.28 8.5,25.59 8.6,25.69 U1.104
VDDD  (via drill 0.25)
  Top 0.2: U1.93 5.3,29.29 5.3,28.79 | v4.8,27.39 5.3,27.89 5.3,28.79 | v20.9,26.89 20,27.79 20,28.09 U1.1 18.8,28.09 18,28.89 14.4,28.89 14.3,28.79 v13.7,28.79 | 5.3,28.79 v11.1,28.79
  Bottom 0.2: 3.9,28.29 C19.2 | v11.1,28.79 v13.7,28.79
  Bottom 0.4: v4.8,27.39 3.9,28.29 | v20.9,26.89 C1.2
VDDXTAL  (via drill 0.25 pad 0.46)
  Top 0.2: U1.120 v15,25.09
  Bottom 0.2: C3.2 15.87,23.25 15.9,23.39
  Bottom 0.4: 15.9,23.39 15.9,24.19 v15,25.09
WEN  (via drill 0.25 pad 0.46)
  Top 0.2: U1.77 5.1,35.69 9.4,31.39 15.1,31.39 15.9,32.19 v15.9,34.49
  Bottom 0.2: U4.21 17.5,32.79 17.1,32.79 15.9,33.99 v15.9,34.49
XTALI
  Top 0.2: U1.122 15.8,25.69 16.3,25.19 16.5,25.19 17.2,24.49 18.6,24.49 X1.2
  Top 0.203: 18.4,22.69 X1.2 | C4.2 18.4,21.29
  Top 0.4: 18.4,21.29 18.4,22.69
XTALO
  Top 0.2: U1.121 15.4,25.49 15.7,25.19 15.7,24.69 X1.1 15,22.99 14.8,22.49
  Top 0.203: X1.1 14.83,23.41
  Top 0.4: C5.2 14.8,21.19 14.8,22.49

### Text on the board
Bottom: r3
Dimension: NO COPPER | Based on the OLinuXino Nano design by Olimex / www.olimex.com
tPlace: w20 cloud | status | setup
tNames: LED1
tValues: XZMDKCBDDG45S
Milling: 1mm router path
Measures: Cloud-connected WiFi Module
dxf: 3
DrillLegend: LAYER-STACK
DrillLegend_01-16: 01-16
DrillLegend_01-20: 01-20